# Altium project PCB_Project.PrjPcb
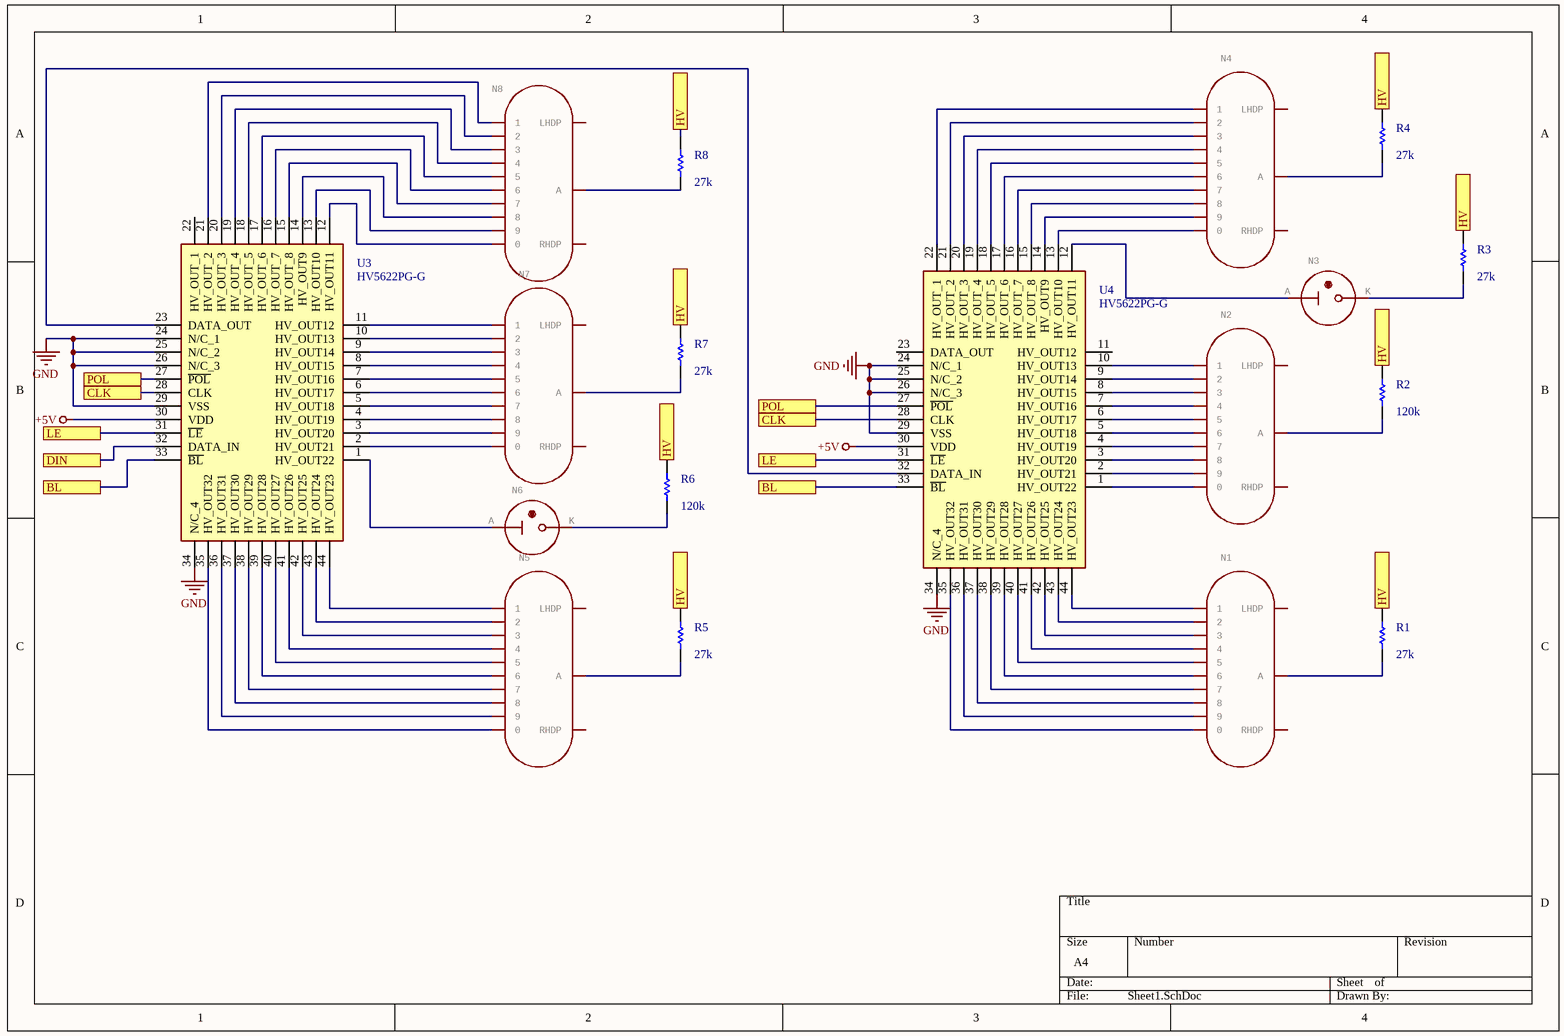
[diagram p0: Sheet1.SchDoc]
2 sheets, 37 parts. Net scope: flat (ports and power ports of the same name join across sheets).
Board file: PCB1.PcbDoc
Sheets:
  Sheet1.SchDoc
  Sheet2.SchDoc

## Sheet Sheet1.SchDoc
size A4

### Parts
N1  IN-14: medium numeric frontview nixie tube  [IN-14]  (value not drawn)
N2  IN-14: medium numeric frontview nixie tube  [IN-14]  (value not drawn)
N3  IN-3: nixie bulb  [IN-3]  (value not drawn)
N4  IN-14: medium numeric frontview nixie tube  [IN-14]  (value not drawn)
N5  IN-14: medium numeric frontview nixie tube  [IN-14]  (value not drawn)
N6  IN-3: nixie bulb  [IN-3]  (value not drawn)
N7  IN-14: medium numeric frontview nixie tube  [IN-14]  (value not drawn)
N8  IN-14: medium numeric frontview nixie tube  [IN-14]  (value not drawn)
R1  value 27k  [AXIAL-0.3]
R2  value 120k  [AXIAL-0.3]
R3  value 27k  [AXIAL-0.3]
R4  value 27k  [AXIAL-0.3]
R5  value 27k  [AXIAL-0.3]
R6  value 120k  [AXIAL-0.3]
R7  value 27k  [AXIAL-0.3]
R8  value 27k  [AXIAL-0.3]
U3  HV5622PG-G  [QFP80P1390X1390X235-44N]
U4  HV5622PG-G  [QFP80P1390X1390X235-44N]

### Ports
BL, CLK, DIN, HV, LE, POL

### Nets
+5V: U3.30(VDD) U4.30(VDD)
GND: U3.24(N/C_1) U3.25(N/C_2) U3.26(N/C_3) U3.29(VSS) U3.34(N/C_4) U4.24(N/C_1) U4.25(N/C_2) U4.26(N/C_3) U4.29(VSS) U4.34(N/C_4)
NetN1_0: N1.0 U4.35(HV_OUT32)
NetN1_1: N1.1 U4.44(HV_OUT23)
NetN1_2: N1.2 U4.43(HV_OUT24)
NetN1_3: N1.3 U4.42(HV_OUT25)
NetN1_4: N1.4 U4.41(HV_OUT26)
NetN1_5: N1.5 U4.40(HV_OUT27)
NetN1_6: N1.6 U4.39(HV_OUT28)
NetN1_7: N1.7 U4.38(HV_OUT29)
NetN1_8: N1.8 U4.37(HV_OUT30)
NetN1_9: N1.9 U4.36(HV_OUT31)
NetN1_A: N1.A R1.2
NetN2_0: N2.0 U4.1(HV_OUT22)
NetN2_1: N2.1 U4.10(HV_OUT13)
NetN2_2: N2.2 U4.9(HV_OUT14)
NetN2_3: N2.3 U4.8(HV_OUT15)
NetN2_4: N2.4 U4.7(HV_OUT16)
NetN2_5: N2.5 U4.6(HV_OUT17)
NetN2_6: N2.6 U4.5(HV_OUT18)
NetN2_7: N2.7 U4.4(HV_OUT19)
NetN2_8: N2.8 U4.3(HV_OUT20)
NetN2_9: N2.9 U4.2(HV_OUT21)
NetN2_A: N2.A R2.2
NetN3_A: N3.A U4.12(HV_OUT11)
NetN3_K: N3.K R3.2
NetN4_0: N4.0 U4.13(HV_OUT10)
NetN4_1: N4.1 U4.22(HV_OUT_1)
NetN4_2: N4.2 U4.21(HV_OUT_2)
NetN4_3: N4.3 U4.20(HV_OUT_3)
NetN4_4: N4.4 U4.19(HV_OUT_4)
NetN4_5: N4.5 U4.18(HV_OUT_5)
NetN4_6: N4.6 U4.17(HV_OUT_6)
NetN4_7: N4.7 U4.16(HV_OUT_7)
NetN4_8: N4.8 U4.15(HV_OUT_8)
NetN4_9: N4.9 U4.14(HV_OUT9)
NetN4_A: N4.A R4.2
NetN5_0: N5.0 U3.35(HV_OUT32)
NetN5_1: N5.1 U3.44(HV_OUT23)
NetN5_2: N5.2 U3.43(HV_OUT24)
NetN5_3: N5.3 U3.42(HV_OUT25)
NetN5_4: N5.4 U3.41(HV_OUT26)
NetN5_5: N5.5 U3.40(HV_OUT27)
NetN5_6: N5.6 U3.39(HV_OUT28)
NetN5_7: N5.7 U3.38(HV_OUT29)
NetN5_8: N5.8 U3.37(HV_OUT30)
NetN5_9: N5.9 U3.36(HV_OUT31)
NetN5_A: N5.A R5.2
NetN6_A: N6.A U3.1(HV_OUT22)
NetN6_K: N6.K R6.2
NetN7_0: N7.0 U3.2(HV_OUT21)
NetN7_1: N7.1 U3.11(HV_OUT12)
NetN7_2: N7.2 U3.10(HV_OUT13)
NetN7_3: N7.3 U3.9(HV_OUT14)
NetN7_4: N7.4 U3.8(HV_OUT15)
NetN7_5: N7.5 U3.7(HV_OUT16)
NetN7_6: N7.6 U3.6(HV_OUT17)
NetN7_7: N7.7 U3.5(HV_OUT18)
NetN7_8: N7.8 U3.4(HV_OUT19)
NetN7_9: N7.9 U3.3(HV_OUT20)
NetN7_A: N7.A R7.2
NetN8_0: N8.0 U3.12(HV_OUT11)
NetN8_1: N8.1 U3.21(HV_OUT_2)
NetN8_2: N8.2 U3.20(HV_OUT_3)
NetN8_3: N8.3 U3.19(HV_OUT_4)
NetN8_4: N8.4 U3.18(HV_OUT_5)
NetN8_5: N8.5 U3.17(HV_OUT_6)
NetN8_6: N8.6 U3.16(HV_OUT_7)
NetN8_7: N8.7 U3.15(HV_OUT_8)
NetN8_8: N8.8 U3.14(HV_OUT9)
NetN8_9: N8.9 U3.13(HV_OUT10)
NetN8_A: N8.A R8.2
NetNCH6100HV_22: R1.1 R2.1 R3.1 R4.1 R5.1 R6.1 R7.1 R8.1 ; port HV
NetU1_23: U3.32(DATA_IN) ; port DIN
NetU1_24: U3.31(~{LE}) U4.31(~{LE}) ; port LE
NetU1_25: U3.28(CLK) U4.28(CLK) ; port CLK
NetU1_26: U3.33(~{BL}) U4.33(~{BL}) ; port BL
NetU1_32: U3.27(~{POL}) U4.27(~{POL}) ; port POL
NetU3_23: U3.23(DATA_OUT) U4.32(DATA_IN)

Not connected (* = marked no-connect by the designer): N1 LHDP RHDP; N2 LHDP RHDP; N4 LHDP RHDP; N5 LHDP RHDP; N7 LHDP RHDP; N8 LHDP RHDP; U3 22(HV_OUT_1); U4 11(HV_OUT12) 23(DATA_OUT)

### Library data of the parts
N1 N2 N4 N5 N7 N8 = IN-14: GateName_1: G$1; SymbolName_1: IN-14; LibraryName: nixies-us; DeviceSetName: IN-14; Package: IN-14
N3 N6 = IN-3: GateName_1: G$1; SymbolName_1: IN-3; LibraryName: nixies-us; DeviceSetName: IN-3; Package: IN-3
R1-R8 = Res1: Resistor; Published: 8-Jun-2000; LatestRevisionDate: 17-Jul-2002; LatestRevisionNote: Re-released for DXP Platform.; PackageReference: AXIAL-0.3; Publisher: Altium Limited; PackageDescription: Axial Device, Thru-Hole; 2 Leads; 0.3 in Pin Spacing
U3 U4 = HV5622PG-G: Integrated Circuit; Manufacturer_Name: Microchip; Allied_Number: 70453262; Datasheet Link: https://componentsearchengine.com/Datasheets/1/HV5622PG-G.pdf; Height: 2.35mm; Manufacturer_Part_Number: HV5622PG-G; Mouser Part Number: 689-HV5622PG-G; Mouser Price/Stock: https://www.mouser.com/Search/Refine.aspx?Keyword=689-HV5622PG-G; Allied Price/Stock: https://www.alliedelec.com/microchiptechnologyinc-hv5622pg-g/70453262/

## Sheet Sheet2.SchDoc
size A4
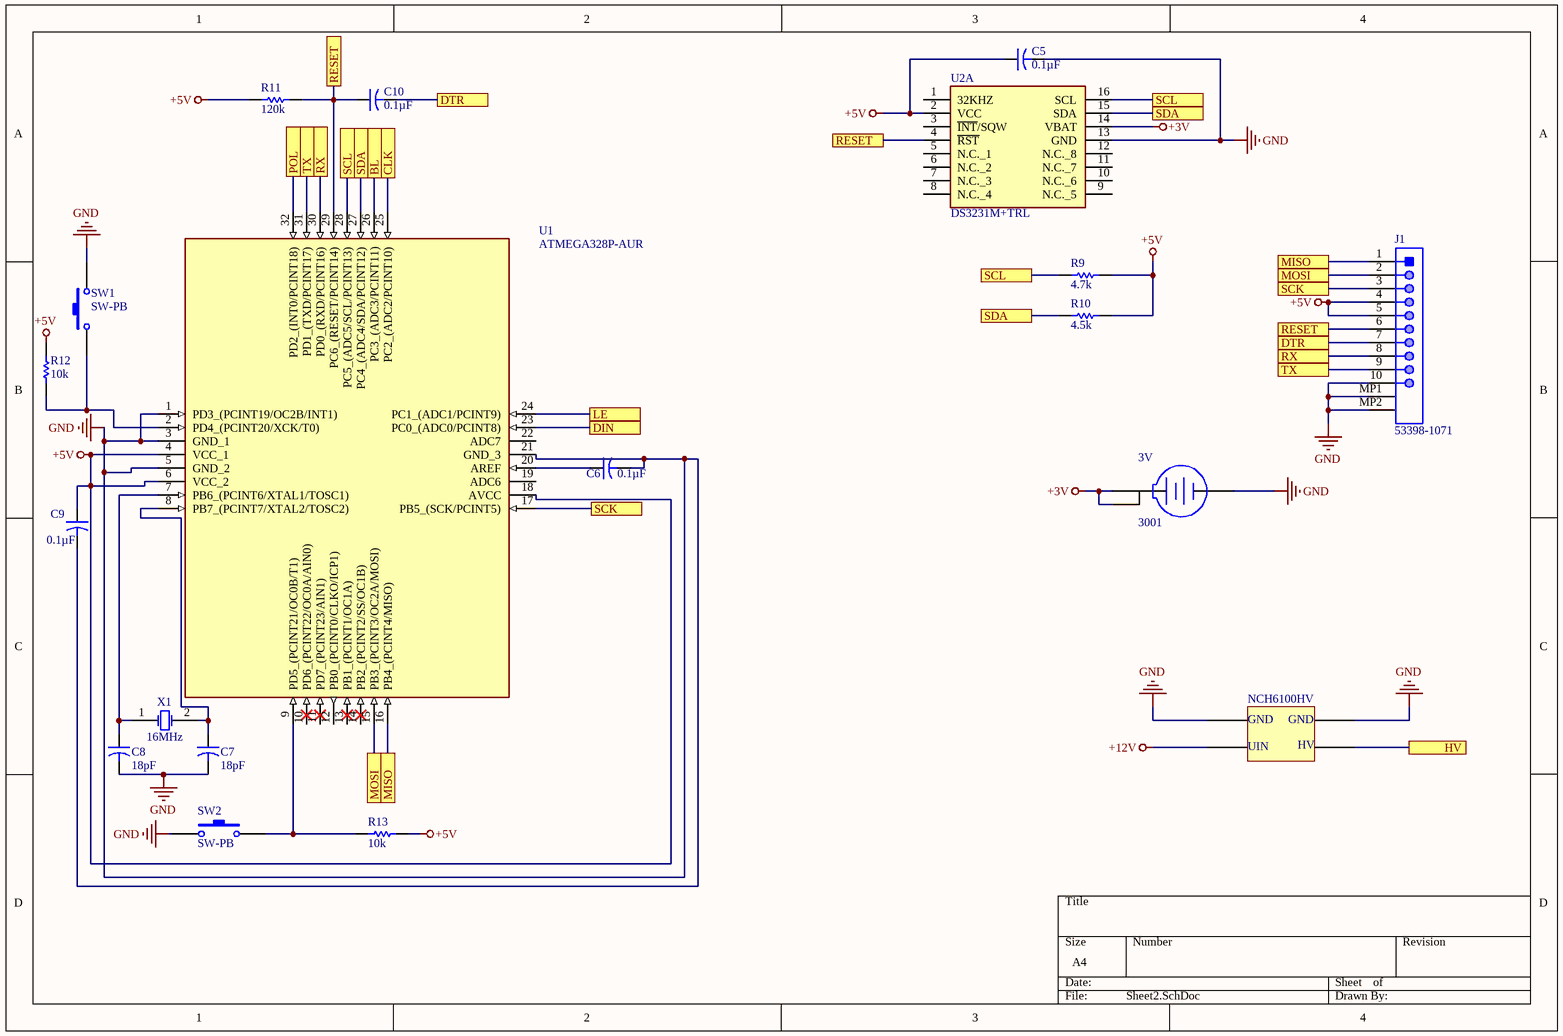
[diagram p1: Sheet2.SchDoc]

### Parts
3V  3001  [KSTN-3001_V]
C5  value 0.1µF  [CAPR5-4X5]
C6  value 0.1µF  [CAPR5-4X5]
C7  value 18pF  [CAPR5-4X5]
C8  value 18pF  [CAPR5-4X5]
C9  value 0.1µF  [CAPR5-4X5]
C10  value 0.1µF  [CAPR5-4X5]
J1  53398-1071  [MOLX-53398-1071_V]
NCH6100HV  NCH6100HV  [NCH6100HV]  (value not drawn)
R9  value 4.7k  [AXIAL-0.3]
R10  value 4.5k  [AXIAL-0.3]
R11  value 120k  [AXIAL-0.3]
R12  value 10k  [AXIAL-0.3]
R13  value 10k  [AXIAL-0.3]
SW1  SW-PB  [SPST-2]
SW2  SW-PB  [SPST-2]
U1  ATMEGA328P-AUR  [QFP80P900X900X120-32N]
U2A  DS3231M+TRL  [SOIC127P1032X265-16N]
X1  16MHz  [R38]

### Ports
BL, CLK, DIN, DTR, HV, LE, MISO, MOSI, POL, RESET, RX, SCK, SCL, SDA, TX

### Nets
+3V: 3V.1(+) 3V.2(+) U2A.14(VBAT)
+5V: C5.1 C9.1 J1.4 J1.5 R9.2 R10.2 R11.1 R12.2 R13.1 U1.4(VCC_1) U1.6(VCC_2) U1.18(AVCC) U2A.2(VCC)
GND: 3V.3(-) C5.2 C6.2 C7.2 C8.2 C9.2 J1.10 J1.MP1 J1.MP2 NCH6100HV.21 SW1.2 SW2.1 U1.1(PD3_(PCINT19/OC2B/INT1)) U1.3(GND_1) U1.5(GND_2) U1.21(GND_3) U2A.13(GND)
NetC6_1: C6.1 U1.20(AREF)
NetC7_1: C7.1 U1.8(PB7_(PCINT7/XTAL2/TOSC2)) X1.2(OSC2)
NetC8_1: C8.1 U1.7(PB6_(PCINT6/XTAL1/TOSC1)) X1.1(OSC1)
NetC10_1: C10.1 J1.6 R11.2 U1.29(PC6_(RESET/PCINT14)) U2A.4(~{RST}) ; port RESET
NetC10_2: C10.2 J1.7 ; port DTR
NetJ1_1: J1.1 U1.16(PB4_(PCINT4/MISO)) ; port MISO
NetJ1_2: J1.2 U1.15(PB3_(PCINT3/OC2A/MOSI)) ; port MOSI
NetJ1_3: J1.3 U1.17(PB5_(SCK/PCINT5)) ; port SCK
NetJ1_8: J1.8 U1.30(PD0_(RXD/PCINT16)) ; port RX
NetJ1_9: J1.9 U1.31(PD1_(TXD/PCINT17)) ; port TX
NetNCH6100HV_22: NCH6100HV.22 ; port HV
NetR9_1: R9.1 U1.28(PC5_(ADC5/SCL/PCINT13)) U2A.16(SCL) ; port SCL
NetR10_1: R10.1 U1.27(PC4_(ADC4/SDA/PCINT12)) U2A.15(SDA) ; port SDA
NetR12_1: R12.1 SW1.1 U1.2(PD4_(PCINT20/XCK/T0))
NetR13_2: R13.2 SW2.2 U1.9(PD5_(PCINT21/OC0B/T1))
NetU1_23: U1.23(PC0_(ADC0/PCINT8)) ; port DIN
NetU1_24: U1.24(PC1_(ADC1/PCINT9)) ; port LE
NetU1_25: U1.25(PC2_(ADC2/PCINT10)) ; port CLK
NetU1_26: U1.26(PC3_(ADC3/PCINT11)) ; port BL
NetU1_32: U1.32(PD2_(INT0/PCINT18)) ; port POL

Not connected (* = marked no-connect by the designer): NCH6100HV 19 20; U1 10(PD6_(PCINT22/OC0A/AIN0)) 11(PD7_(PCINT23/AIN1)) 12(PB0_(PCINT0/CLKO/ICP1)) 13(PB1_(PCINT1/OC1A)) 14(PB2_(PCINT2/SS/OC1B)) 19(ADC6) 22(ADC7); U2A 1(32KHZ) 3(~{INT}/SQW) 5(N.C._1) 6(N.C._2) 7(N.C._3) 8(N.C._4) 9(N.C._5) 10(N.C._6) 11(N.C._7) 12(N.C._8)

### Notes on the sheet
- (in symbol NCH6100HV) GND; UIN; HV

### Library data of the parts
3V = CMP-2000-05463-1: Holder Battery Coin, 12 mm, 2-Pin THD, RoHS; Manufacturer: Keystone; Package Reference: 3001; Package Description: 2-Pin Through Hole Device, Body 13.21 x 12.07 mm; Datasheet Version: Rev. H, 09/2006; Datasheet URL: https://datasheet.ciiva.com/3/3001-3954.pdf; Mounting Technology: ThroughHole; Manufacturer URL: http://www.keyelco.com/
C5-C10 = Cap2: Capacitor; Published: 23-Sep-2002; PackageReference: CAPR5-4X5; Publisher: Altium Limited; PackageDescription: Capacitor; 2 Leads
J1 = CMP-2000-05635-1: Male Header, Pitch 1.25 mm, 1 x 10 Position, Height 4.7 mm, -40 to 85 degC, RoHS, Tape and Reel; Manufacturer: Molex; Mounting Angle: Vertical; Pitch: 1.25mm; Voltage Rating: 125V; Current Rating: 1A; Number of Rows: 1Row; Housing Material: Nylon; Mounting Technology: SurfaceMount; Mounting Style: SMD; Contact Material: PhosphorBronze; Product: Headers; Datasheet URL: http://www.molex.com/pdm_docs/sd/533981071_sd.pdf; Manufacturer URL: http://www.molex.com/; Datasheet Version: Rev. J, 09/2015; Factory Pack Quantity: 1000; Brand: Molex; Packaging: Reel; Product Category: Headers&WireHousings; Contact Gender: Pin(Male); Number of Positions: 10Position; RoHS: Details; Contact Plating: Tin; Package Description: Male Header, Pitch 1.25 mm, 1 x 10 Position, Height 4.7 mm; Series: 53398; Type: Shrouded; Package Reference: 53398-1071; Tradename: PicoBlade; Termination Style: SMD
R9-R13 = Res1: Resistor; Published: 8-Jun-2000; LatestRevisionDate: 17-Jul-2002; LatestRevisionNote: Re-released for DXP Platform.; PackageReference: AXIAL-0.3; Publisher: Altium Limited; PackageDescription: Axial Device, Thru-Hole; 2 Leads; 0.3 in Pin Spacing
SW1 SW2 = SW-PB: Switch; Published: 24-Mar-1999; LatestRevisionDate: 17-Jul-2002; LatestRevisionNote: Re-released for DXP Platform.; PackageReference: SPST-2; Publisher: Altium Limited; PackageDescription: Switch; 2 Leads
U1 = ATMEGA328P-AUR: Integrated Circuit; Manufacturer_Name: Microchip; Datasheet Link: http://www.farnell.com/datasheets/1693866.pdf; Height: 1.2mm; Manufacturer_Part_Number: ATMEGA328P-AUR; Mouser Part Number: 556-ATMEGA328P-AUR; Mouser Price/Stock: https://www.mouser.com/Search/Refine.aspx?Keyword=556-ATMEGA328P-AUR; RS Part Number: 1773264P; RS Price/Stock: http://uk.rs-online.com/web/p/products/1773264P
U2A = DS3231M+TRL: Integrated Circuit; Manufacturer_Name: Maxim Integrated; Datasheet Link: http://componentsearchengine.com/Datasheets/1/DS3231M+TRL.pdf; Height: 2.65mm; Manufacturer_Part_Number: DS3231M+TRL; Mouser Part Number: 700-DS3231M+TRL; Mouser Price/Stock: https://www.mouser.com/Search/Refine.aspx?Keyword=700-DS3231M%2BTRL
X1 = XTAL: Crystal Oscillator; Published: 8-Jun-2000; LatestRevisionDate: 17-Jul-2002; LatestRevisionNote: Re-released for DXP Platform.; PackageReference: R38; Publisher: Altium Limited; PackageDescription: Crystal, Thru-Hole; 2 Leads; Body 3.1 x 8.2 mm (Dia.xH)

## Nets that join several sheets
+5V: Sheet1 (U3.30 U4.30), Sheet2 (13 pins)
GND: Sheet1 (10 pins), Sheet2 (17 pins)
NetNCH6100HV_22: Sheet1 (8 pins), Sheet2 (NCH6100HV.22)
NetU1_23: Sheet1 (U3.32), Sheet2 (U1.23)
NetU1_24: Sheet1 (U3.31 U4.31), Sheet2 (U1.24)
NetU1_25: Sheet1 (U3.28 U4.28), Sheet2 (U1.25)
NetU1_26: Sheet1 (U3.33 U4.33), Sheet2 (U1.26)
NetU1_32: Sheet1 (U3.27 U4.27), Sheet2 (U1.32)